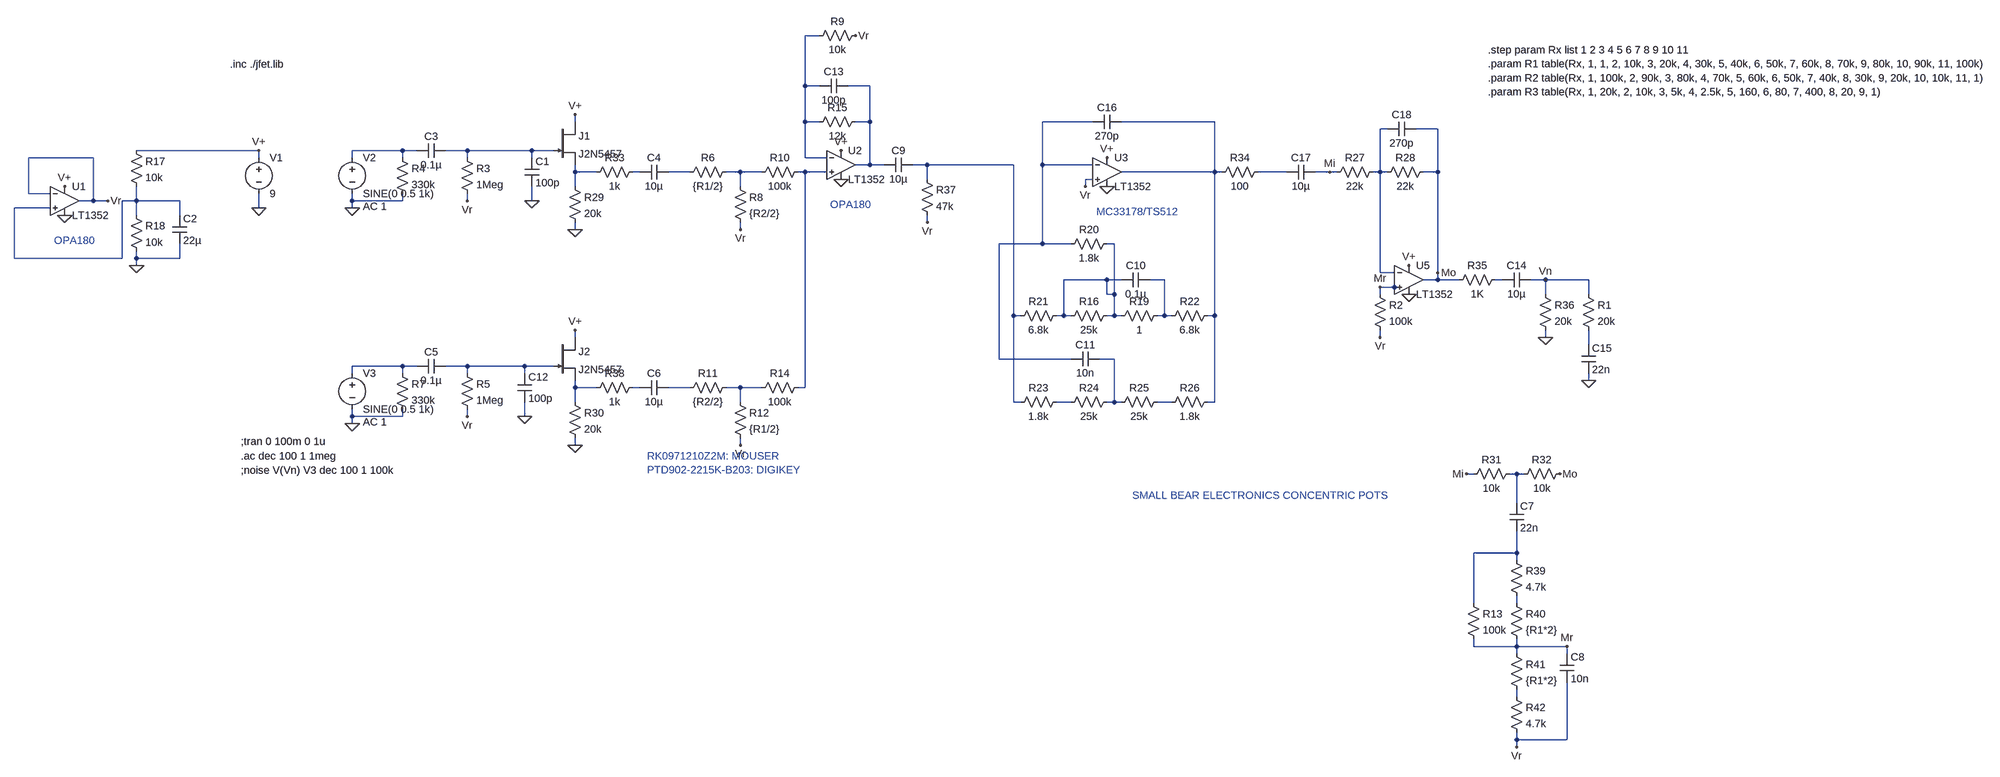
[diagram p0: schematic CB_BGP_V0.asc]
CB_BGP_V0.asc, the LTspice schematic file:
Version 4
SHEET 1 5112 4608
WIRE 1424 -192 1392 -192
WIRE 1392 -80 1392 -192
WIRE 1424 -80 1392 -80
WIRE 1536 -80 1488 -80
WIRE 880 0 880 -16
WIRE 1392 0 1392 -80
WIRE 1424 0 1392 0
WIRE 1536 0 1536 -80
WIRE 1536 0 1504 0
WIRE 2032 0 1920 0
WIRE 2304 0 2096 0
WIRE 2688 16 2672 16
WIRE 2800 16 2752 16
WIRE 176 64 -96 64
WIRE 496 64 384 64
WIRE 528 64 496 64
WIRE 640 64 592 64
WIRE 784 64 640 64
WIRE 832 64 784 64
WIRE -192 80 -336 80
WIRE 176 80 176 64
WIRE 384 80 384 64
WIRE 496 80 496 64
WIRE 640 80 640 64
WIRE 784 80 784 64
WIRE 1392 80 1392 0
WIRE 1440 80 1392 80
WIRE 1536 96 1536 0
WIRE 1536 96 1504 96
WIRE 1568 96 1536 96
WIRE 1664 96 1632 96
WIRE 1856 96 1664 96
WIRE 1920 96 1920 0
WIRE 2032 96 1920 96
WIRE 880 112 880 96
WIRE 928 112 880 112
WIRE 1024 112 1008 112
WIRE 1136 112 1088 112
WIRE 1248 112 1216 112
WIRE 1296 112 1248 112
WIRE 1392 112 1376 112
WIRE 1440 112 1392 112
WIRE 2304 112 2304 0
WIRE 2304 112 2096 112
WIRE 2320 112 2304 112
WIRE 2464 112 2400 112
WIRE 2560 112 2528 112
WIRE 2576 112 2560 112
WIRE 2672 112 2672 16
WIRE 2672 112 2656 112
WIRE 2688 112 2672 112
WIRE 2800 112 2800 16
WIRE 2800 112 2768 112
WIRE 1664 128 1664 96
WIRE 2032 128 2016 128
WIRE 880 144 880 112
WIRE 1248 144 1248 112
WIRE 2016 144 2016 128
WIRE -336 160 -336 80
WIRE -288 160 -336 160
WIRE -192 176 -192 80
WIRE -192 176 -224 176
WIRE -160 176 -192 176
WIRE -96 176 -96 144
WIRE -96 176 -128 176
WIRE 0 176 -96 176
WIRE 384 176 384 160
WIRE 496 176 496 160
WIRE 496 176 384 176
WIRE 640 176 640 160
WIRE 784 176 784 144
WIRE -288 192 -368 192
WIRE 176 192 176 160
WIRE 384 192 384 176
WIRE -96 208 -96 176
WIRE 0 208 0 176
WIRE 1664 224 1664 208
WIRE 880 240 880 224
WIRE 1248 240 1248 224
WIRE 1920 272 1920 96
WIRE 1920 272 1824 272
WIRE 1984 272 1920 272
WIRE 2080 272 2064 272
WIRE -368 304 -368 192
WIRE -128 304 -128 176
WIRE -128 304 -368 304
WIRE -96 304 -96 288
WIRE 0 304 0 272
WIRE 0 304 -96 304
WIRE -96 320 -96 304
WIRE 2672 336 2672 112
WIRE 2704 336 2672 336
WIRE 2800 336 2800 112
WIRE 2064 352 1968 352
WIRE 2096 352 2064 352
WIRE 2192 352 2160 352
WIRE 2800 352 2800 336
WIRE 2800 352 2768 352
WIRE 2848 352 2800 352
WIRE 2944 352 2928 352
WIRE 3040 352 3008 352
WIRE 3136 352 3040 352
WIRE 2704 368 2672 368
WIRE 2720 368 2704 368
WIRE 2064 384 2064 352
WIRE 2080 384 2080 272
WIRE 2080 384 2064 384
WIRE 2672 384 2672 368
WIRE 3040 384 3040 352
WIRE 3136 384 3136 352
WIRE 1856 432 1856 96
WIRE 1872 432 1856 432
WIRE 1968 432 1968 352
WIRE 1968 432 1952 432
WIRE 1984 432 1968 432
WIRE 2080 432 2080 384
WIRE 2080 432 2064 432
WIRE 2096 432 2080 432
WIRE 2192 432 2192 352
WIRE 2192 432 2176 432
WIRE 2208 432 2192 432
WIRE 2304 432 2304 112
WIRE 2304 432 2288 432
WIRE 880 480 880 464
WIRE 2672 480 2672 464
WIRE 3040 480 3040 464
WIRE 3136 496 3136 464
WIRE 1824 528 1824 272
WIRE 1984 528 1824 528
WIRE 2080 528 2048 528
WIRE 496 544 384 544
WIRE 528 544 496 544
WIRE 640 544 592 544
WIRE 768 544 640 544
WIRE 832 544 768 544
WIRE 384 560 384 544
WIRE 496 560 496 544
WIRE 640 560 640 544
WIRE 768 560 768 544
WIRE 3136 576 3136 560
WIRE 880 592 880 576
WIRE 928 592 880 592
WIRE 1024 592 1008 592
WIRE 1136 592 1088 592
WIRE 1248 592 1216 592
WIRE 1296 592 1248 592
WIRE 1392 592 1392 112
WIRE 1392 592 1376 592
WIRE 880 624 880 592
WIRE 1248 624 1248 592
WIRE 1856 624 1856 432
WIRE 1872 624 1856 624
WIRE 1984 624 1952 624
WIRE 2080 624 2080 528
WIRE 2080 624 2064 624
WIRE 2096 624 2080 624
WIRE 2208 624 2176 624
WIRE 2304 624 2304 432
WIRE 2304 624 2288 624
WIRE 384 656 384 640
WIRE 496 656 496 640
WIRE 496 656 384 656
WIRE 640 656 640 640
WIRE 768 656 768 624
WIRE 384 672 384 656
WIRE 880 720 880 704
WIRE 1248 720 1248 704
WIRE 2880 784 2864 784
WIRE 2976 784 2960 784
WIRE 2992 784 2976 784
WIRE 2976 848 2976 784
WIRE 2976 960 2976 912
WIRE 2976 960 2880 960
WIRE 2976 976 2976 960
WIRE 2880 1072 2880 960
WIRE 2976 1072 2976 1056
WIRE 2880 1168 2880 1152
WIRE 2976 1168 2976 1152
WIRE 2976 1168 2880 1168
WIRE 3088 1168 2976 1168
WIRE 2976 1184 2976 1168
WIRE 3088 1184 3088 1168
WIRE 2976 1280 2976 1264
WIRE 2976 1376 2976 1360
WIRE 3088 1376 3088 1248
WIRE 3088 1376 2976 1376
WIRE 2976 1392 2976 1376
FLAG 384 192 0
FLAG 880 -16 V+
FLAG 384 672 0
FLAG 880 464 V+
FLAG 1472 64 V+
FLAG 2064 80 V+
FLAG 3040 480 0
FLAG 3040 352 Vn
FLAG 2736 320 V+
FLAG 176 64 V+
FLAG 176 192 0
FLAG 2672 368 Mr
FLAG 2560 112 Mi
FLAG 3072 784 Mo
FLAG 2864 784 Mi
FLAG 3088 1168 Mr
FLAG 784 176 0
FLAG 880 240 0
FLAG 880 720 0
FLAG -96 320 0
FLAG -256 144 V+
FLAG -160 176 Vr
FLAG 640 656 Vr
FLAG 1248 720 Vr
FLAG 640 176 Vr
FLAG 1248 240 Vr
FLAG 2016 144 Vr
FLAG 2976 1392 Vr
FLAG -256 208 0
FLAG 1472 128 0
FLAG 2064 144 0
FLAG 2736 384 0
FLAG 1664 224 Vr
FLAG 768 656 0
FLAG 1504 -192 Vr
FLAG 3136 576 0
FLAG 2672 480 Vr
FLAG 2800 336 Mo
SYMBOL voltage 176 64 R0
WINDOW 123 0 0 Left 2
WINDOW 39 0 0 Left 2
SYMATTR InstName V1
SYMATTR Value 9
SYMBOL voltage 384 64 R0
WINDOW 123 24 124 Left 2
WINDOW 39 0 0 Left 2
SYMATTR Value2 AC 1
SYMATTR InstName V2
SYMATTR Value SINE(0 0.5 1k)
SYMBOL res 624 64 R0
SYMATTR InstName R3
SYMATTR Value 1Meg
SYMBOL res 480 64 R0
SYMATTR InstName R4
SYMATTR Value 330k
SYMBOL cap 592 48 R90
WINDOW 0 0 32 VBottom 2
WINDOW 3 32 32 VTop 2
SYMATTR InstName C3
SYMATTR Value 0.1µ
SYMBOL njf 832 0 R0
SYMATTR InstName J1
SYMATTR Value J2N5457
SYMBOL cap 1088 96 R90
WINDOW 0 0 32 VBottom 2
WINDOW 3 32 32 VTop 2
SYMATTR InstName C4
SYMATTR Value 10µ
SYMBOL voltage 384 544 R0
WINDOW 123 24 124 Left 2
WINDOW 39 0 0 Left 2
SYMATTR Value2 AC 1
SYMATTR InstName V3
SYMATTR Value SINE(0 0.5 1k)
SYMBOL res 624 544 R0
SYMATTR InstName R5
SYMATTR Value 1Meg
SYMBOL res 480 544 R0
SYMATTR InstName R7
SYMATTR Value 330k
SYMBOL cap 592 528 R90
WINDOW 0 0 32 VBottom 2
WINDOW 3 32 32 VTop 2
SYMATTR InstName C5
SYMATTR Value 0.1µ
SYMBOL njf 832 480 R0
SYMATTR InstName J2
SYMATTR Value J2N5457
SYMBOL cap 1088 576 R90
WINDOW 0 0 32 VBottom 2
WINDOW 3 32 32 VTop 2
SYMATTR InstName C6
SYMATTR Value 10µ
SYMBOL res 1232 96 R90
WINDOW 0 0 56 VBottom 2
WINDOW 3 32 56 VTop 2
SYMATTR InstName R6
SYMATTR Value {R1/2}
SYMBOL res 1232 128 R0
SYMATTR InstName R8
SYMATTR Value {R2/2}
SYMBOL res 1392 96 R90
WINDOW 0 0 56 VBottom 2
WINDOW 3 32 56 VTop 2
SYMATTR InstName R10
SYMATTR Value 100k
SYMBOL res 1232 576 R90
WINDOW 0 0 56 VBottom 2
WINDOW 3 32 56 VTop 2
SYMATTR InstName R11
SYMATTR Value {R2/2}
SYMBOL res 1232 608 R0
SYMATTR InstName R12
SYMATTR Value {R1/2}
SYMBOL res 1392 576 R90
WINDOW 0 0 56 VBottom 2
WINDOW 3 32 56 VTop 2
SYMATTR InstName R14
SYMATTR Value 100k
SYMBOL res 1520 -16 R90
WINDOW 0 0 56 VBottom 2
WINDOW 3 32 56 VTop 2
SYMATTR InstName R15
SYMATTR Value 12k
SYMBOL cap 1632 80 R90
WINDOW 0 0 32 VBottom 2
WINDOW 3 32 32 VTop 2
SYMATTR InstName C9
SYMATTR Value 10µ
SYMBOL res 2192 416 R90
WINDOW 0 0 56 VBottom 2
WINDOW 3 32 56 VTop 2
SYMATTR InstName R19
SYMATTR Value 1
SYMBOL cap 2160 336 R90
WINDOW 0 0 32 VBottom 2
WINDOW 3 32 32 VTop 2
SYMATTR InstName C10
SYMATTR Value 0.1µ
SYMBOL res 2080 256 R90
WINDOW 0 0 56 VBottom 2
WINDOW 3 32 56 VTop 2
SYMATTR InstName R20
SYMATTR Value 1.8k
SYMBOL res 1968 416 R90
WINDOW 0 0 56 VBottom 2
WINDOW 3 32 56 VTop 2
SYMATTR InstName R21
SYMATTR Value 6.8k
SYMBOL res 2304 416 R90
WINDOW 0 0 56 VBottom 2
WINDOW 3 32 56 VTop 2
SYMATTR InstName R22
SYMATTR Value 6.8k
SYMBOL res 1968 608 R90
WINDOW 0 0 56 VBottom 2
WINDOW 3 32 56 VTop 2
SYMATTR InstName R23
SYMATTR Value 1.8k
SYMBOL res 2080 608 R90
WINDOW 0 0 56 VBottom 2
WINDOW 3 32 56 VTop 2
SYMATTR InstName R24
SYMATTR Value 25k
SYMBOL res 2192 608 R90
WINDOW 0 0 56 VBottom 2
WINDOW 3 32 56 VTop 2
SYMATTR InstName R25
SYMATTR Value 25k
SYMBOL res 2304 608 R90
WINDOW 0 0 56 VBottom 2
WINDOW 3 32 56 VTop 2
SYMATTR InstName R26
SYMATTR Value 1.8k
SYMBOL cap 2048 512 R90
WINDOW 0 0 32 VBottom 2
WINDOW 3 32 32 VTop 2
SYMATTR InstName C11
SYMATTR Value 10n
SYMBOL res 2416 96 R90
WINDOW 0 0 56 VBottom 2
WINDOW 3 32 56 VTop 2
SYMATTR InstName R34
SYMATTR Value 100
SYMBOL cap 3008 336 R90
WINDOW 0 0 32 VBottom 2
WINDOW 3 32 32 VTop 2
SYMATTR InstName C14
SYMATTR Value 10µ
SYMBOL res 2944 336 R90
WINDOW 0 0 56 VBottom 2
WINDOW 3 32 56 VTop 2
SYMATTR InstName R35
SYMATTR Value 1K
SYMBOL res 3024 368 R0
SYMATTR InstName R36
SYMATTR Value 20k
SYMBOL res 1648 112 R0
SYMATTR InstName R37
SYMATTR Value 47k
SYMBOL res 2672 96 R90
WINDOW 0 0 56 VBottom 2
WINDOW 3 32 56 VTop 2
SYMATTR InstName R27
SYMATTR Value 22k
SYMBOL res 2784 96 R90
WINDOW 0 0 56 VBottom 2
WINDOW 3 32 56 VTop 2
SYMATTR InstName R28
SYMATTR Value 22k
SYMBOL cap 2096 -16 R90
WINDOW 0 0 32 VBottom 2
WINDOW 3 32 32 VTop 2
SYMATTR InstName C16
SYMATTR Value 270p
SYMBOL cap 2528 96 R90
WINDOW 0 0 32 VBottom 2
WINDOW 3 32 32 VTop 2
SYMATTR InstName C17
SYMATTR Value 10µ
SYMBOL res 2976 768 R90
WINDOW 0 0 56 VBottom 2
WINDOW 3 32 56 VTop 2
SYMATTR InstName R31
SYMATTR Value 10k
SYMBOL res 3088 768 R90
WINDOW 0 0 56 VBottom 2
WINDOW 3 32 56 VTop 2
SYMATTR InstName R32
SYMATTR Value 10k
SYMBOL cap 2960 848 R0
SYMATTR InstName C7
SYMATTR Value 22n
SYMBOL res 2960 960 R0
SYMATTR InstName R39
SYMATTR Value 4.7k
SYMBOL res 2960 1056 R0
SYMATTR InstName R40
SYMATTR Value {R1*2}
SYMBOL res 2960 1168 R0
SYMATTR InstName R41
SYMATTR Value {R1*2}
SYMBOL res 2960 1264 R0
SYMATTR InstName R42
SYMATTR Value 4.7k
SYMBOL cap 3072 1184 R0
SYMATTR InstName C8
SYMATTR Value 10n
SYMBOL cap 768 80 R0
SYMATTR InstName C1
SYMATTR Value 100p
SYMBOL res 864 608 R0
SYMATTR InstName R30
SYMATTR Value 20k
SYMBOL res -112 48 R0
SYMATTR InstName R17
SYMATTR Value 10k
SYMBOL res -112 192 R0
SYMATTR InstName R18
SYMATTR Value 10k
SYMBOL cap -16 208 R0
SYMATTR InstName C2
SYMATTR Value 22µ
SYMBOL res 864 128 R0
SYMATTR InstName R29
SYMATTR Value 20k
SYMBOL cap 752 560 R0
SYMATTR InstName C12
SYMATTR Value 100p
SYMBOL res 1024 96 R90
WINDOW 0 0 56 VBottom 2
WINDOW 3 32 56 VTop 2
SYMATTR InstName R33
SYMATTR Value 1k
SYMBOL res 1024 576 R90
WINDOW 0 0 56 VBottom 2
WINDOW 3 32 56 VTop 2
SYMATTR InstName R38
SYMATTR Value 1k
SYMBOL cap 1488 -96 R90
WINDOW 0 0 32 VBottom 2
WINDOW 3 32 32 VTop 2
SYMATTR InstName C13
SYMATTR Value 100p
SYMBOL Opamps\\LT1352 -256 112 R0
SYMATTR InstName U1
SYMBOL Opamps\\LT1352 1472 32 R0
SYMATTR InstName U2
SYMBOL Opamps\\LT1352 2064 48 R0
SYMATTR InstName U3
SYMBOL Opamps\\LT1352 2736 288 R0
SYMATTR InstName U5
SYMBOL res 1520 -208 R90
WINDOW 0 0 56 VBottom 2
WINDOW 3 32 56 VTop 2
SYMATTR InstName R9
SYMATTR Value 10k
SYMBOL res 3120 368 R0
SYMATTR InstName R1
SYMATTR Value 20k
SYMBOL cap 3120 496 R0
SYMATTR InstName C15
SYMATTR Value 22n
SYMBOL res 2656 368 R0
SYMATTR InstName R2
SYMATTR Value 100k
SYMBOL res 2864 1056 R0
SYMATTR InstName R13
SYMATTR Value 100k
SYMBOL cap 2752 0 R90
WINDOW 0 0 32 VBottom 2
WINDOW 3 32 32 VTop 2
SYMATTR InstName C18
SYMATTR Value 270p
SYMBOL res 2080 416 R90
WINDOW 0 0 56 VBottom 2
WINDOW 3 32 56 VTop 2
SYMATTR InstName R16
SYMATTR Value 25k
TEXT 112 -128 Left 2 !.inc ./jfet.lib
TEXT 136 712 Left 2 !;tran 0 100m 0 1u
TEXT 136 744 Left 2 !.ac dec 100 1 1meg
TEXT 1448 184 Left 2 ;OPA180
TEXT 1040 744 Left 2 ;RK0971210Z2M: MOUSER\nPTD902-2215K-B203: DIGIKEY
TEXT 2040 200 Left 2 ;MC33178/TS512
TEXT 2912 -160 Left 2 !.step param Rx list 1 2 3 4 5 6 7 8 9 10 11\n.param R1 table(Rx, 1, 1, 2, 10k, 3, 20k, 4, 30k, 5, 40k, 6, 50k, 7, 60k, 8, 70k, 9, 80k, 10, 90k, 11, 100k)\n.param R2 table(Rx, 1, 100k, 2, 90k, 3, 80k, 4, 70k, 5, 60k, 6, 50k, 7, 40k, 8, 30k, 9, 20k, 10, 10k, 11, 1)\n.param R3 table(Rx, 1, 20k, 2, 10k, 3, 5k, 4, 2.5k, 5, 160, 6, 80, 7, 400, 8, 20, 9, 1)
TEXT 136 776 Left 2 !;noise V(Vn) V3 dec 100 1 100k
TEXT 2120 832 Left 2 ;SMALL BEAR ELECTRONICS CONCENTRIC POTS
TEXT -280 264 Left 2 ;OPA180

The netlist it stands for:
* CB_BGP_V0.asc
V1 V+ 0 9
V2 N006 0 SINE(0 0.5 1k) AC 1
R3 N007 Vr 1Meg
R4 N006 0 330k
C3 N007 N006 0.1µ
J1 V+ N007 N009 J2N5457
C4 N011 N010 10µ
V3 N021 0 SINE(0 0.5 1k) AC 1
R5 N022 Vr 1Meg
R7 N021 0 330k
C5 N022 N021 0.1µ
J2 V+ N022 N023 J2N5457
C6 N025 N024 10µ
R6 N012 N011 {R1/2}
R8 N012 Vr {R2/2}
R10 N013 N012 100k
R11 N026 N025 {R2/2}
R12 N026 Vr {R1/2}
R14 N013 N026 100k
R15 N002 N001 12k
C9 N008 N002 10µ
R19 N017 N016 1
C10 N017 N016 0.1µ
R20 N016 N003 1.8k
R21 N016 N008 6.8k
R22 N004 N017 6.8k
R23 N027 N008 1.8k
R24 N020 N027 25k
R25 N028 N020 25k
R26 N004 N028 1.8k
C11 N020 N003 10n
R34 N014 N004 100
C14 Vn N018 10µ
R35 N018 Mo 1K
R36 Vn 0 20k
R37 N008 Vr 47k
R27 N005 Mi 22k
R28 Mo N005 22k
C16 N004 N003 270p
C17 Mi N014 10µ
R31 N029 Mi 10k
R32 Mo N029 10k
C7 N029 N030 22n
R39 N030 N031 4.7k
R40 N031 Mr {R1*2}
R41 Mr N032 {R1*2}
R42 N032 Vr 4.7k
C8 Mr Vr 10n
C1 N007 0 100p
R30 N023 0 20k
R17 V+ N015 10k
R18 N015 0 10k
C2 N015 0 22µ
R29 N009 0 20k
C12 N022 0 100p
R33 N010 N009 1k
R38 N024 N023 1k
C13 N002 N001 100p
XU1 N015 Vr V+ 0 Vr LT1352  ; pins In+ In- V+ V- OUT
XU2 N013 N001 V+ 0 N002 LT1352  ; pins In+ In- V+ V- OUT
XU3 Vr N003 V+ 0 N004 LT1352  ; pins In+ In- V+ V- OUT
XU5 Mr N005 V+ 0 Mo LT1352  ; pins In+ In- V+ V- OUT
R9 Vr N001 10k
R1 Vn N019 20k
C15 N019 0 22n
R2 Mr Vr 100k
R13 N030 Mr 100k
C18 Mo N005 270p
R16 N016 N016 25k
.model NJF NJF
.model PJF PJF
.lib standard.jft
.inc ./jfet.lib
;tran 0 100m 0 1u
.ac dec 100 1 1meg
* OPA180
* RK0971210Z2M: MOUSER
* PTD902-2215K-B203: DIGIKEY
* MC33178/TS512
.step param Rx list 1 2 3 4 5 6 7 8 9 10 11
.param R1 table(Rx, 1, 1, 2, 10k, 3, 20k, 4, 30k, 5, 40k, 6, 50k, 7, 60k, 8, 70k, 9, 80k, 10, 90k, 11, 100k)
.param R2 table(Rx, 1, 100k, 2, 90k, 3, 80k, 4, 70k, 5, 60k, 6, 50k, 7, 40k, 8, 30k, 9, 20k, 10, 10k, 11, 1)
.param R3 table(Rx, 1, 20k, 2, 10k, 3, 5k, 4, 2.5k, 5, 160, 6, 80, 7, 400, 8, 20, 9, 1)
;noise V(Vn) V3 dec 100 1 100k
* SMALL BEAR ELECTRONICS CONCENTRIC POTS
* OPA180
.lib LTC.lib
.backanno
.end